# EasyEDA Pro project ProPrj_辉光管_2024.2.16_2024-11-09.epro, board PCB13
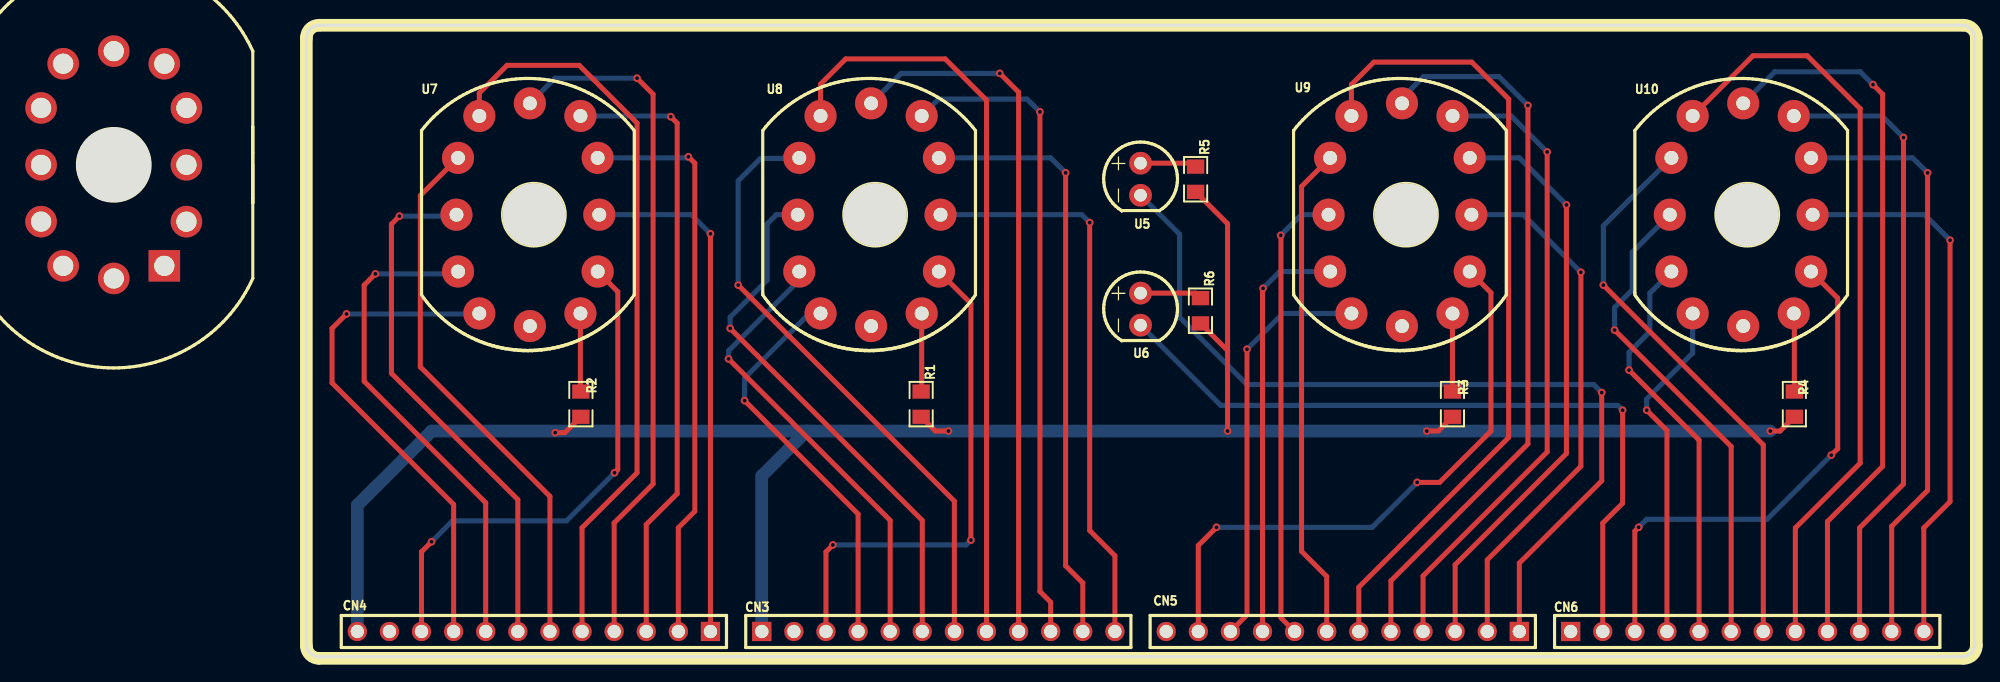
[diagram p8: board, top side]
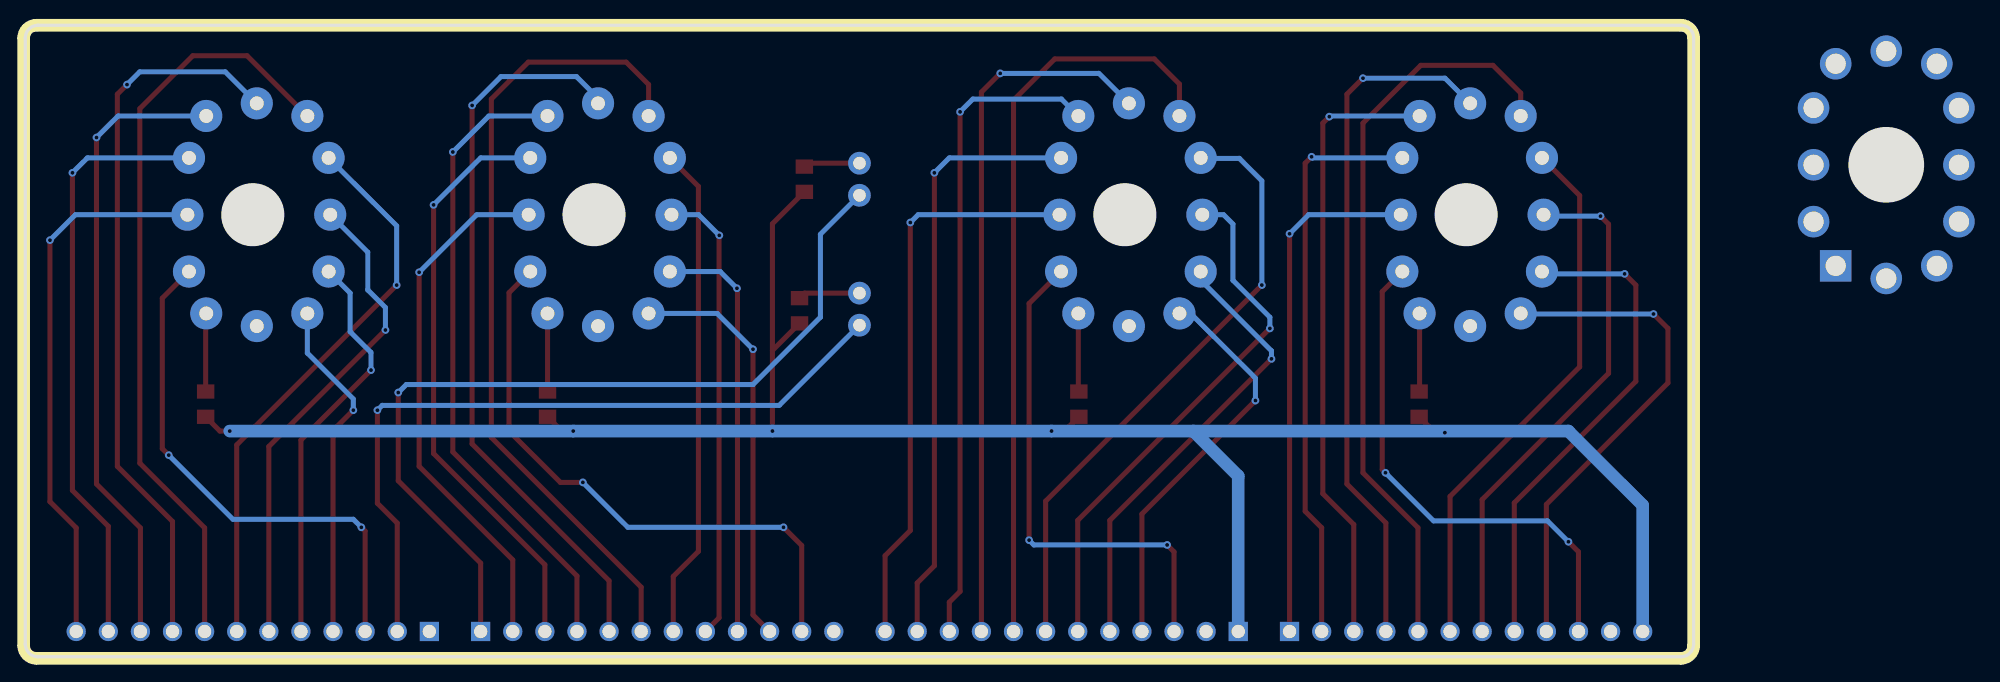
[diagram p9: board, bottom side, seen from below]

Outline 150.24 x 50 mm; copper layers: Top Layer, Bottom Layer. Coordinates in mm from the lower left corner of the outline.
Outline path: 18.24,49 18.24,1 arc(18.53,0.29) 19.24,0 149.24,0 arc(149.94,0.29) 150.24,1 150.24,49 arc(149.94,49.71) 149.24,50 19.24,50 arc(18.53,49.71) 18.24,49
Stack: Top Layer 0.035mm / Dielectric1 1.51mm FR4 er 4.5 / Bottom Layer 0.035mm

## Design rules (mm)
template: JLCPCB Capability(Two Layers Board)
spacing copperThickness1oz (default): track to track 0.102, other pairs 0.152 to 0.3
spacing copperThickness2oz: track to track 0.203, other pairs 0.152 to 0.3
track width copperThickness1oz (default): min 0.127, default 0.254, max 2.54
track width copperThickness2oz: min 0.203, default 0.254, max 2.54
differential pair differentialPair (default): width min 0.127, default 0.254, max 2.54; gap min 0.152, default 0.152
via viaSize (default): diameter min 0.5, default 0.61, max 10; hole min 0.3, default 0.305, max 6.3

## Placement (name value [footprint] x y rotation side)
CN3  HB-PH3-254112PB2GOP  [HDR-TH_12P-P2.54-V-M]  68.24 2 0 top
CN4  HB-PH3-254112PB2GOP  [HDR-TH_12P-P2.54-V-M]  36.24 2 180 top
CN5  HB-PH3-254112PB2GOP  [HDR-TH_12P-P2.54-V-M]  100.24 2 180 top
CN6  HB-PH3-254112PB2GOP  [HDR-TH_12P-P2.54-V-M]  132.24 2 0 top
R1  33kΩ  [R0805]  66.88 20 270 top
R2  33kΩ  [R0805]  39.95 20 270 top
R3  33kΩ  [R0805]  108.91 20 270 top
R4  33kΩ  [R0805]  135.96 20 270 top
R5  47kΩ  [R0805]  88.59 37.81 270 top
R6  47kΩ  [R0805]  88.97 27.39 270 top
U1  -  [IN-12#2]  3 38.95 0 top
U5  LTL-307E  [LED-TH_BD5.9-P2.54-RD_RED]  84.24 37.81 90 top
U6  LTL-307E  [LED-TH_BD5.9-P2.54-RD_RED]  84.24 27.52 90 top
U7  -  [IN-12]  36.24 35 0 top
U8  -  [IN-12]  63.24 35 0 top
U9  -  [IN-12]  105.24 35 0 top
U10  -  [IN-12]  132.24 35 0 top

## Footprints (pads in the part's own frame, mm; a bottom-side part is the same pattern mirrored in y, then rotated)
HDR-TH_12P-P2.54-V-M
  rect 1.524x1.524 hole 1.05: 1(-13.97,0)
  round 1.524 hole 1.05: 2(-11.43,0) 3(-8.89,0) 4(-6.35,0) 5(-3.81,0) 6(-1.27,0) 7(1.27,0) 8(3.81,0) 9(6.35,0) 10(8.89,0) 11(11.43,0) 12(13.97,0)
IN-12
  round 2.54 hole 1.1: 0(5.048,-4.5) 1(-4.317,-7.817) 2(-6,-4.5) 3(-6.127,0) 4(-6,4.5) 5(-4.317,7.817) 6(-0.318,8.818) 7(3.683,7.817) 8(5.048,4.5) 9(5.175,0) A(3.683,-7.817) LHDP(-0.318,-8.818)
IN-12#2
  rect 2.5x2.5 hole 1.6: 1(4,-8)
  round 2.5 hole 1.6: 2(5.75,-4.501) 3(5.75,0) 4(5.75,4.501) 5(4,8.001) 6(0,8.999) 7(-4,8.001) 8(-5.75,4.501) 9(-5.75,0) 10(-5.75,-4.501) 11(-4,-8.001) 12(0,-8.999)
LED-TH_BD5.9-P2.54-RD_RED
  round 1.8 hole 1: 1(-1.27,0) 2(1.27,0)
R0805
  rect 1.133x1.377 smd: 1(-1,0) 2(1,0)

## Nets
G1_0: CN4.10 U7.0
G1_1: CN4.9 U7.1
G1_2: CN4.8 U7.2
G1_3: CN4.7 U7.3
G1_4: CN4.6 U7.4
G1_5: CN4.5 U7.5
G1_6: CN4.4 U7.6
G1_7: CN4.3 U7.7
G1_8: CN4.2 U7.8
G1_9: CN4.1 U7.9
G2_0: CN3.3 U8.0
G2_1: CN3.4 U8.1
G2_2: CN3.5 U8.2
G2_3: CN3.6 U8.3
G2_4: CN3.7 U8.4
G2_5: CN3.8 U8.5
G2_6: CN3.9 U8.6
G2_7: CN3.10 U8.7
G2_8: CN3.11 U8.8
G2_9: CN3.12 U8.9
G3_0: CN5.11 U9.0
G3_1: CN5.10 U9.1
G3_2: CN5.9 U9.2
G3_3: CN5.8 U9.3
G3_4: CN5.7 U9.4
G3_5: CN5.6 U9.5
G3_6: CN5.5 U9.6
G3_7: CN5.4 U9.7
G3_8: CN5.3 U9.8
G3_9: CN5.2 U9.9
G4_0: CN6.3 U10.0
G4_1: CN6.4 U10.1
G4_2: CN6.5 U10.2
G4_3: CN6.6 U10.3
G4_4: CN6.7 U10.4
G4_5: CN6.8 U10.5
G4_6: CN6.9 U10.6
G4_7: CN6.10 U10.7
G4_8: CN6.11 U10.8
G4_9: CN6.12 U10.9
HGD_1: CN5.1 U5.1
HGD_2: CN6.2 U6.1
HV: CN3.1 CN4.12 R1.2 R2.2 R3.2 R4.2 R5.2 R6.2
$1N925: R5.1 U5.2
$1N929: R6.1 U6.2
$1N970: R2.1 U7.A
$1N973: R1.1 U8.A
$1N994: R3.1 U9.A
$1N996: R4.1 U10.A

Pads without a net: CN3 2; CN4 11; CN5 12; CN6 1; U1 1 2 3 4 5 6 7 8 9 10 11 12; U7 LHDP; U8 LHDP; U9 LHDP; U10 LHDP

## Via types
v1: diameter 0.61, hole 0.305, Top Layer to Bottom Layer, 45 vias

## Routing (per net, layer and track width the routed paths; a pad name or vN(x,y) marks a point on that pad's centre or on a via; arc(x,y) is an arc through that point)
G1_0: length 40.9
  Top Layer w0.4: CN4.10 27.35,8.31 v1(28.14,9.11) ; v1(42.62,14.57) 42.87,14.82 42.87,28.91 U7.0
  Bottom Layer w0.4: v1(42.62,14.57) 38.81,10.76 29.79,10.76 v1(28.14,9.11)
G1_1: length 40.1
  Top Layer w0.4: CN4.9 29.89,12.06 20.27,21.68 20.27,26 v1(21.41,27.14)
  Bottom Layer w0.4: U7.1 31.88,27.14 v1(21.41,27.14)
G1_2: length 39.3
  Top Layer w0.4: v1(23.7,30.31) 22.81,29.43 22.81,21.81 32.43,12.19 CN4.8
  Bottom Layer w0.4: U7.2 30.05,30.31 v1(23.7,30.31)
G1_3: length 41.8
  Top Layer w0.4: v1(25.6,34.89) 24.97,34.25 24.97,22.44 34.97,12.44 CN4.7
  Bottom Layer w0.4: U7.3 30,34.89 v1(25.6,34.89)
G1_4: length 43
  Top Layer w0.4: CN4.6 37.51,12.7 27.25,22.95 27.25,36.52 U7.4
G1_5: length 59.2
  Top Layer w0.4: U7.5 31.92,44.63 34.11,46.83 39.83,46.83 44.4,42.25 44.4,14.57 40.05,10.22 CN4.5
G1_6: length 54.9
  Top Layer w0.4: CN4.4 42.59,10.6 45.67,13.68 45.67,44.54 v1(44.4,45.81)
  Bottom Layer w0.4: v1(44.4,45.81) 37.91,45.81 U7.6
G1_7: length 49.2
  Top Layer w0.4: v1(47.06,42.76) 47.57,42.25 47.57,12.92 45.13,10.47 CN4.3
  Bottom Layer w0.4: v1(47.06,42.76) 47.01,42.82 U7.7
G1_8: length 45.6
  Top Layer w0.4: v1(48.46,39.59) 48.97,39.08 48.97,11.52 47.67,10.22 CN4.2
  Bottom Layer w0.4: U7.8 48.38,39.5 v1(48.46,39.59)
G1_9: length 40.9
  Top Layer w0.4: CN4.1 v1(50.21,33.49)
  Bottom Layer w0.4: U7.9 48.7,35 v1(50.21,33.49)
G2_0: length 40.5
  Top Layer w0.4: CN3.3 59.35,8.31 v1(59.89,8.85) ; U8.0 70.81,27.97 v1(70.81,9.23)
  Bottom Layer w0.4: v1(59.89,8.85) 70.43,8.85 v1(70.81,9.23)
G2_1: length 31.9
  Top Layer w0.4: v1(52.91,20.28) 61.89,11.3 CN3.4
  Bottom Layer w0.4: v1(52.91,20.28) 52.91,22.06 58.03,27.18 U8.1
G2_2: length 36.1
  Top Layer w0.4: v1(51.64,23.58) 64.43,10.8 CN3.5
  Bottom Layer w0.4: U8.2 57.24,29.82 51.64,24.22 v1(51.64,23.58)
G2_3: length 42.5
  Top Layer w0.4: CN3.6 66.97,10.8 v1(51.76,26)
  Bottom Layer w0.4: v1(51.76,26) 51.76,26.89 54.68,29.81 54.68,34.25 55.43,35 U8.3
G2_4: length 48.4
  Top Layer w0.4: v1(52.4,29.43) 69.51,12.32 CN3.7
  Bottom Layer w0.4: v1(52.4,29.43) 52.4,37.68 54.18,39.46 57.19,39.46 U8.4
G2_5: length 59.9
  Top Layer w0.4: U8.5 58.92,45.34 60.91,47.33 68.78,47.33 72.05,44.07 CN3.8
G2_6: length 56
  Top Layer w0.4: v1(73.1,46.19) 74.59,44.7 CN3.9
  Bottom Layer w0.4: U8.6 65.29,46.19 v1(73.1,46.19)
G2_7: length 51.8
  Top Layer w0.4: v1(76.27,43.14) 76.27,5.17 77.13,4.32 CN3.10
  Bottom Layer w0.4: U8.7 68.26,44.16 75.26,44.16 v1(76.27,43.14)
G2_8: length 47.4
  Top Layer w0.4: v1(78.31,38.32) 78.31,7.2 79.67,5.84 CN3.11
  Bottom Layer w0.4: v1(78.31,38.32) 77.12,39.5 U8.8
G2_9: length 45.3
  Top Layer w0.4: v1(80.21,34.38) 80.21,10 82.21,8 CN3.12
  Bottom Layer w0.4: v1(80.21,34.38) 79.59,35 U8.9
G3_0: length 47
  Top Layer w0.4: CN5.11 88.81,8.81 v1(90.24,10.25) ; U9.0 111.96,28.82 111.96,17.87 107.9,13.81 v1(106.12,13.81)
  Bottom Layer w0.4: v1(106.12,13.81) 102.56,10.25 v1(90.24,10.25)
G3_1: length 32.3
  Top Layer w0.4: CN5.10 92.66,3.31 v1(92.66,24.35)
  Bottom Layer w0.4: U9.1 95.49,27.18 v1(92.66,24.35)
G3_2: length 33
  Top Layer w0.4: CN5.9 93.89,29.13 v1(93.93,29.17)
  Bottom Layer w0.4: U9.2 95.26,30.5 v1(93.93,29.17)
G3_3: length 36.3
  Top Layer w0.4: v1(95.32,33.36) 95.34,33.34 95.34,3.08 CN5.8
  Bottom Layer w0.4: v1(95.32,33.36) 96.96,35 U9.3
G3_4: length 39.3
  Top Layer w0.4: CN5.7 98.97,6.35 96.98,8.34 96.98,37.24 U9.4
G3_5: length 63.9
  Top Layer w0.4: CN5.6 101.51,5.51 113.36,17.36 113.36,44.16 110.44,47.08 102.69,47.08 100.92,45.31 U9.5
G3_6: length 58.2
  Top Layer w0.4: CN5.5 104.05,6.02 114.88,16.85 v1(114.88,43.65)
  Bottom Layer w0.4: v1(114.88,43.65) 112.6,45.94 106.63,45.94 104.92,44.23 U9.6
G3_7: length 50.7
  Top Layer w0.4: CN5.4 106.59,6.4 116.41,16.22 v1(116.41,39.97)
  Bottom Layer w0.4: v1(116.41,39.97) 113.56,42.82 U9.7
G3_8: length 46.6
  Top Layer w0.4: CN5.3 109.13,7.29 117.93,16.09 v1(117.93,35.78)
  Bottom Layer w0.4: v1(117.93,35.78) 114.21,39.5 U9.8
G3_9: length 42.1
  Top Layer w0.4: CN5.2 111.67,7.67 119.07,15.08 v1(119.07,30.44)
  Bottom Layer w0.4: v1(119.07,30.44) 114.52,35 U9.9
G4_0: length 41.6
  Top Layer w0.4: v1(123.65,10.25) 123.35,9.95 CN6.3 ; v1(138.89,15.96) 139.39,16.47 139.39,28.39 U10.0
  Bottom Layer w0.4: v1(138.89,15.96) 133.81,10.88 124.28,10.88 v1(123.65,10.25)
G4_1: length 27.4
  Top Layer w0.4: v1(124.28,19.52) 125.89,17.92 CN6.4
  Bottom Layer w0.4: v1(124.28,19.52) 124.28,20.41 127.92,24.05 U10.1
G4_2: length 32.2
  Top Layer w0.4: CN6.5 128.43,17.15 v1(122.88,22.69)
  Bottom Layer w0.4: v1(122.88,22.69) 122.88,24.09 124.53,25.74 124.53,28.8 U10.2
G4_3: length 38.6
  Top Layer w0.4: CN6.6 130.97,16.64 v1(121.74,25.87)
  Bottom Layer w0.4: U10.3 123.14,32.03 123.14,29.05 121.74,27.65 v1(121.74,25.87)
G4_4: length 45
  Top Layer w0.4: CN6.7 133.51,16.77 v1(120.85,29.43)
  Bottom Layer w0.4: v1(120.85,29.43) 120.85,34.12 U10.4
G4_5: length 60.5
  Top Layer w0.4: CN6.8 136.05,10.2 141.17,15.33 141.17,43.4 136.98,47.59 132.69,47.59 U10.5
G4_6: length 57.1
  Top Layer w0.4: v1(142.19,45.3) 142.95,44.54 142.95,15.08 138.59,10.71 CN6.9
  Bottom Layer w0.4: v1(142.19,45.3) 141.17,46.32 134.42,46.32 U10.6
G4_7: length 49.9
  Top Layer w0.4: v1(144.6,41.11) 144.6,13.68 141.13,10.2 CN6.10
  Bottom Layer w0.4: U10.7 142.89,42.82 v1(144.6,41.11)
G4_8: length 47.2
  Top Layer w0.4: CN6.11 143.67,10.33 146.51,13.17 v1(146.51,38.32)
  Bottom Layer w0.4: v1(146.51,38.32) 145.32,39.5 U10.8
G4_9: length 43.6
  Top Layer w0.4: v1(148.28,32.98) 148.28,12.28 146.21,10.2 CN6.12
  Bottom Layer w0.4: v1(148.28,32.98) 146.27,35 U10.9
HGD_1: length 68.4
  Top Layer w0.4: CN5.1 114.21,7.41 120.72,13.93 v1(120.72,20.92)
  Bottom Layer w0.4: U5.1 87.32,33.45 87.32,26.89 92.66,21.55 120.09,21.55 v1(120.72,20.92)
HGD_2: length 59.1
  Top Layer w0.4: CN6.2 120.81,10.58 122.38,12.15 v1(122.38,19.52)
  Bottom Layer w0.4: U6.1 90.59,19.9 121.99,19.9 v1(122.38,19.52)
HV: length 174.6
  Top Layer w0.4: R5.2 91.12,34.28 91.12,24.25 ; R6.2 91.12,24.25 ; 91.12,24.25 v1(91.12,17.87) ; R3.2 107.78,17.87 v1(106.88,17.87) ; v1(134.06,17.87) 134.83,17.87 R4.2 ; R2.2 38.69,17.74 v1(37.92,17.74) ; R1.2 68.01,17.87 v1(69.04,17.87)
  Bottom Layer w1: CN4.12 22.27,11.99 28.14,17.87 57.82,17.87 ; 57.82,17.87 54.27,14.32 CN3.1 ; 57.82,17.87 v1(69.04,17.87) v1(91.12,17.87) v1(106.88,17.87) v1(134.06,17.87)
$1N925: length 4.5
  Top Layer w0.4: U5.2 88.32,39.08 R5.1
$1N929: length 4.9
  Top Layer w0.4: R6.1 88.58,28.79 U6.2
$1N970: length 6.2
  Top Layer w0.4: U7.A 39.92,21.03 R2.1
$1N973: length 6.2
  Top Layer w0.4: R1.1 66.92,21.04 U8.A
$1N994: length 6.2
  Top Layer w0.4: R3.1 108.91,27.18 U9.A
$1N996: length 6.2
  Top Layer w0.4: R4.1 135.96,27.14 U10.A
